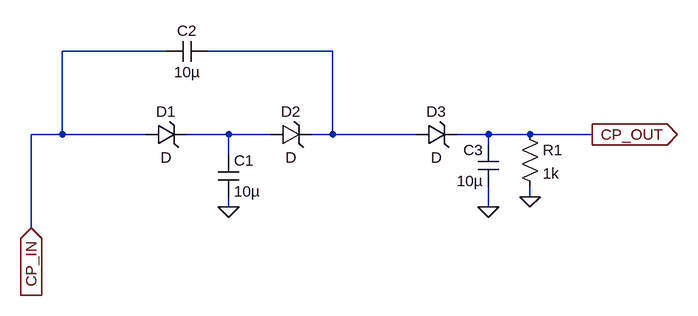
[diagram p0: schematic ChargePump.asc]
ChargePump.asc, the LTspice schematic file:
Version 4
SHEET 1 1000 680
WIRE 208 160 48 160
WIRE 464 160 272 160
WIRE 48 288 48 160
WIRE 48 288 0 288
WIRE 176 288 48 288
WIRE 304 288 240 288
WIRE 368 288 304 288
WIRE 464 288 464 160
WIRE 464 288 432 288
WIRE 592 288 464 288
WIRE 704 288 656 288
WIRE 768 288 704 288
WIRE 864 288 768 288
WIRE 704 304 704 288
WIRE 304 320 304 288
WIRE 768 384 768 368
WIRE 304 400 304 384
WIRE 704 400 704 368
WIRE 0 432 0 288
FLAG 304 400 0
FLAG 704 400 0
FLAG 768 384 0
FLAG 0 432 CP_IN
IOPIN 0 432 In
FLAG 864 288 CP_OUT
IOPIN 864 288 Out
SYMBOL zener 176 304 R270
WINDOW 0 36 32 VTop 2
WINDOW 3 -4 32 VBottom 2
SYMATTR InstName D1
SYMBOL zener 368 304 R270
WINDOW 0 36 32 VTop 2
WINDOW 3 -4 32 VBottom 2
SYMATTR InstName D2
SYMBOL zener 592 304 R270
WINDOW 0 36 32 VTop 2
WINDOW 3 -4 32 VBottom 2
SYMATTR InstName D3
SYMBOL Cap 288 320 R0
SYMATTR InstName C1
SYMATTR Value 10µ
SYMBOL Cap 272 144 R90
WINDOW 0 0 32 VBottom 2
WINDOW 3 32 32 VTop 2
SYMATTR InstName C2
SYMATTR Value 10µ
SYMBOL Cap 720 368 R180
WINDOW 0 24 56 Left 2
WINDOW 3 24 8 Left 2
SYMATTR InstName C3
SYMATTR Value 10µ
SYMBOL Res 752 272 R0
SYMATTR InstName R1
SYMATTR Value 1k

The netlist it stands for:
* ChargePump.asc
D1 CP_IN N002 D
D2 N002 N001 D
D3 N001 CP_OUT D
C1 N002 0 10µ
C2 N001 CP_IN 10µ
C3 0 CP_OUT 10µ
R1 CP_OUT 0 1k
.model D D
.lib standard.dio
.backanno
.end